# EasyEDA Pro project ProPrj_KiwiKey_2025-07-17.epro

# Schematic MainBoard
Board Name: MainBoard; Create Date: 2025-07-17; Page Name: P1; Project Name: KiwiKey; Schematic Name: MainBoard; Update Date: 2025-07-17; Company: EasyEDA.com; Drawn: 2025-07-17; Page Size: A4; Reviewed: 2025-07-17; Version: V1.0
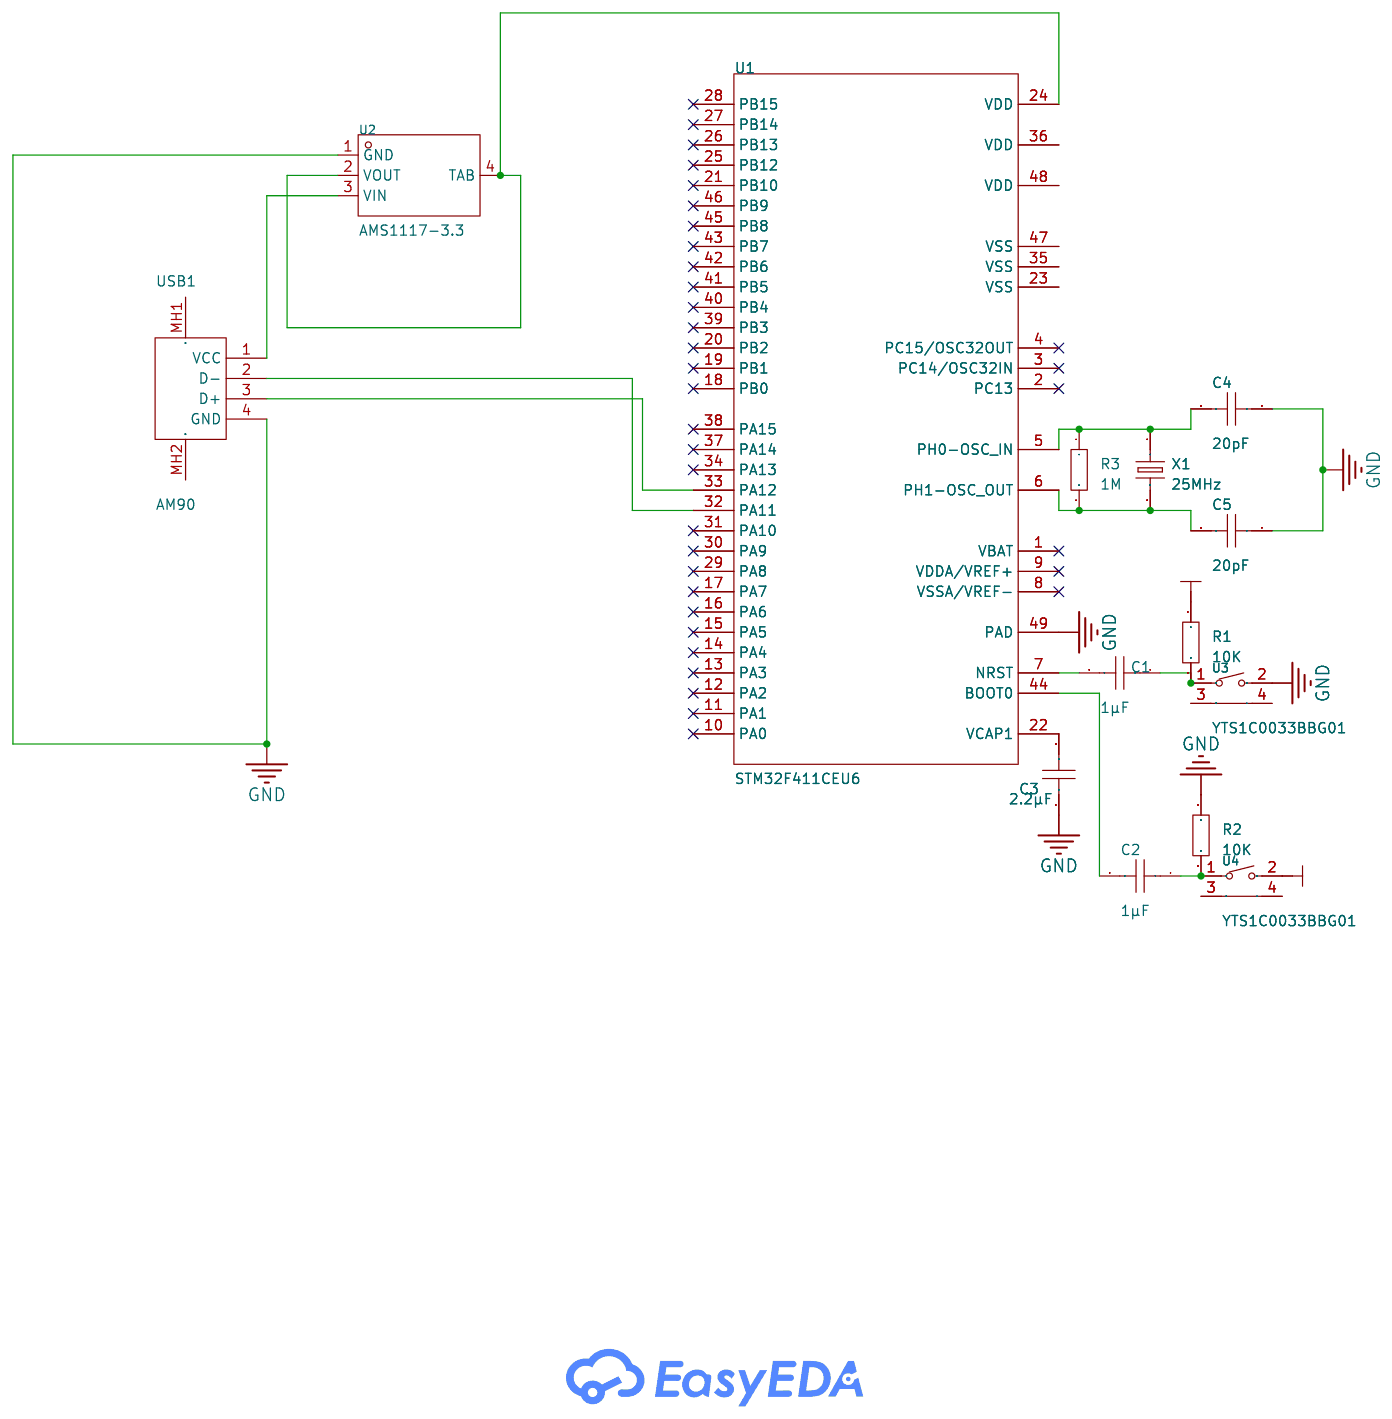
[diagram p0: schematic sheet]

## Parts
C1  1µF  [C0603]
C2  1µF  [C0603]
C3  2.2µF  [C0603]
C4  20pF  [C0603]
C5  20pF  [C0603]
R1  10K  [R0603]
R2  10K  [R0603]
R3  1M  [R0603]
U1  STM32F411CEU6  [UFQFPN-48_L7.0-W7.0-P0.50-BL-EP]
U2  AMS1117-3.3  [SOT-223-3_L6.5-W3.4-P2.30-LS7.0-BR]
U3  YTS1C0033BBG01  [SW-SMD_YIYUAN_YTS1C003XXX]
U4  YTS1C0033BBG01  [SW-SMD_YIYUAN_YTS1C003XXX]
USB1  AM90  [USB-AM-TH_AM90]
X1  25MHz  [HC-49US_L11.5-W4.5-P4.88]

## Library data of the parts
C1-C5 = CAP_0603: Supplier Footprint: 0603
R1-R3 = Res_0603: Supplier Footprint: 0603
U1 = STM32F411CEU6: CPU Core:ARM-M4 CPU Maximum Speed:100MHz Program Storage Size:512KB Program Memory Type:FLASH Number of I/O:36 ADC (Bit):12bit Voltage - Supply:1.7V~3.6V Voltage - Supply:1.7V~3.6V Applications:-; LCSC Part Name: 带DSP和FPU的高性能基本型系列ARM Cortex-M4 MCU，具有512 KB Flash、100 MHz CPU和ART加速器; Supplier Part: C60420; Manufacturer: ST(意法半导体); Supplier Footprint: UFQFPN-48(7x7); JLCPCB Part Class: Extended Part; Datasheet: https://atta.szlcsc.com/upload/public/pdf/source/20151026/1457707507170.pdf; Supplier: LCSC; CPU Core: ARM-M4; CPU Maximum Speed: 100MHz; Program Storage Size: 512KB; Program Memory Type: FLASH; Number of I/O: 36; ADC (Bit): 12bit; Voltage - Supply: 1.7V~3.6V
U2 = AMS1117-3.3_C351784: Output Type: Maximum Input Voltage:18V Output Voltage:3.3V Output Voltage:3.3V MAX Output Current:800mA Power Supply Rejection Ratio (PSRR):- Dropout Voltage:1.4V@(1A) Output Polarity:Positive electrode Number of Outputs:1; LCSC Part Name: 输入18V 输出3.3V 800mA; Supplier Part: C351784; Manufacturer: PUOLOP(迪浦); Supplier Footprint: SOT-223-3; JLCPCB Part Class: Extended Part; Datasheet: https://atta.szlcsc.com/upload/public/pdf/source/20210915/EA806799CEEC3F52E0A4FA8303A508AC.pdf; Supplier: LCSC; Maximum Input Voltage: 18V; Output Voltage: 3.3V; MAX Output Current: 800mA; Dropout Voltage: 1.4V@(1A); Output Polarity: Positive electrode; Number of Outputs: 1
U3 U4 = YTS1C0033BBG01: LCSC Part Name: 侧按键3x6x3.8 黑钮贴片; Supplier Part: C5188566; Manufacturer: YIYUAN(怡远); Supplier Footprint: SMD; JLCPCB Part Class: Extended Part; Datasheet: https://atta.szlcsc.com/upload/public/pdf/source/20230613/7D2A610AF4C94741A450B980E2010797.pdf; Supplier: LCSC
USB1 = AM90: Connector Type:Type-A Standard:USB 2.0 Gender:Public Mounting Style:Bend-in Number of Contacts:4P Number of Ports:1 Current Rating - Power (Max):1.5A Rated Voltage (Max):30V Connect-Disconnect Life:5000 Cuts Supplementary Features:- Center Height:- Length; LCSC Part Name: Type-A 公 弯插; Supplier Part: C404965; Manufacturer: SHOU HAN(首韩); Supplier Footprint: 插件; JLCPCB Part Class: Extended Part; Datasheet: https://atta.szlcsc.com/upload/public/pdf/source/20190722/C404965_9CC10BE28E3F9E5134758D030387C529.pdf; Supplier: LCSC; Connector Type: Type-A; Standard: USB 2.0; Gender: Public; Mounting Style: Bend-in; Number of Contacts: 4P; Number of Ports: 1; Current Rating - Power (Max): 1.5A; Rated Voltage (Max): 30V; Connect-Disconnect Life: 5000 Cuts; Length: 18.8mm; Core Colour: White; Operating Temperature Range: -25℃~+85℃
X1 = XIHCELNANF-25MHZ: Crystal Type:直插晶振 Frequency:25MHz Normal temperature Frequency Tolerance:±30ppm Normal temperature Frequency Tolerance:±30ppm External load capacitor:20pF Frequency Stability(Full temperature range):±30ppm Frequency Stability(Full temperature range):±30pp; LCSC Part Name: 25MHz ±30ppm 20pF; Supplier Part: C295079; Manufacturer: TAITIEN(泰艺电子); Supplier Footprint: HC-49S; JLCPCB Part Class: Extended Part; Datasheet: https://atta.szlcsc.com/upload/public/pdf/source/20190107/C358649_B3943D1FEB8737E4FCE005A191A94016.pdf; Supplier: LCSC; Crystal Type: 直插晶振; Normal temperature Frequency Tolerance: ±30ppm; External load capacitor: 20pF; Frequency Stability(Full temperature range): ±30ppm

## Nets
3.3V: R1.1 U4.2
GND: C3.1 C4.1 C5.1 R2.1 U1.49(PAD) U2.1(GND) U3.2 USB1.4(GND)
Net-(C1-1): C1.1 R1.2 U3.1
Net-(C1-2): C1.2 U1.7(NRST)
Net-(C2-1): C2.1 R2.2 U4.1
Net-(C2-2): C2.2 U1.44(BOOT0)
Net-(C3-2): C3.2 U1.22(VCAP1)
Net-(C4-2): C4.2 R3.1 U1.5(PH0-OSC_IN) X1.1
Net-(C5-2): C5.2 R3.2 U1.6(PH1-OSC_OUT) X1.2
Net-(U1-24): U1.24(VDD) U2.2(VOUT) U2.4(TAB)
Net-(U1-32): U1.32(PA11) USB1.2(D-)
Net-(U1-33): U1.33(PA12) USB1.3(D+)
Net-(U2-3): U2.3(VIN) USB1.1(VCC)

Not connected (* = marked no-connect by the designer): U1 1(VBAT)* 2(PC13)* 3(PC14/OSC32IN)* 4(PC15/OSC32OUT)* 8(VSSA/VREF-)* 9(VDDA/VREF+)* 10(PA0)* 11(PA1)* 12(PA2)* 13(PA3)* 14(PA4)* 15(PA5)* 16(PA6)* 17(PA7)* 18(PB0)* 19(PB1)* 20(PB2)* 21(PB10)* 23(VSS) 25(PB12)* 26(PB13)* 27(PB14)* 28(PB15)* 29(PA8)* 30(PA9)* 31(PA10)* 34(PA13)* 35(VSS) 36(VDD) 37(PA14)* 38(PA15)* 39(PB3)* 40(PB4)* 41(PB5)* 42(PB6)* 43(PB7)* 45(PB8)* 46(PB9)* 47(VSS) 48(VDD); U3 3 4; U4 3 4; USB1 MH1 MH2

# Board PCB1_1
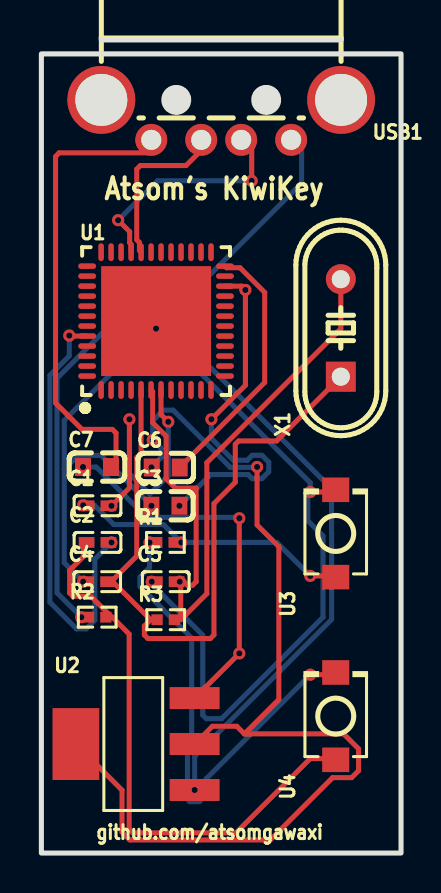
[diagram p1: board, top side]
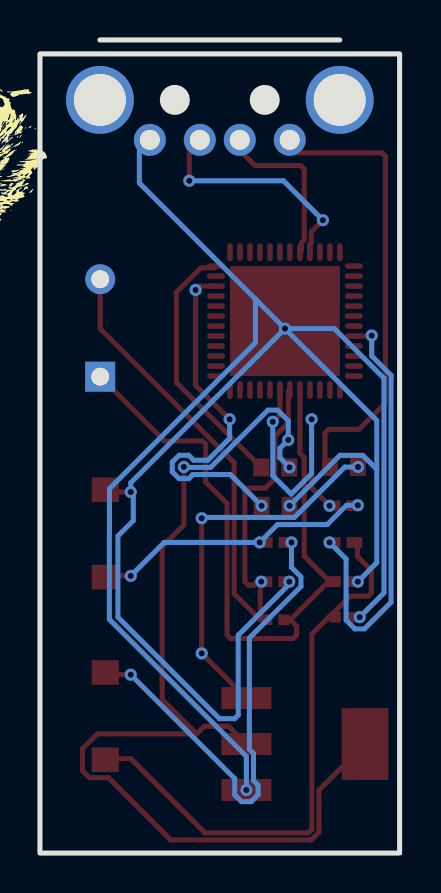
[diagram p2: board, bottom side, seen from below]

Outline 18 x 40.7 mm; copper layers: Top Layer, Bottom Layer. Coordinates in mm from the lower left corner of the outline.
Outline path: rectangle 0,40 18,0
Stack: Top Layer 0.035mm / Dielectric1 1.51mm FR4 er 4.5 / Bottom Layer 0.035mm

## Design rules (mm)
template: JLCPCB Capability(Two Layers Board)
spacing copperThickness1oz (default): track to track 0.102, other pairs 0.152 to 0.3
spacing copperThickness2oz: track to track 0.203, other pairs 0.152 to 0.3
track width copperThickness1oz (default): min 0.127, default 0.254, max 2.54
track width copperThickness2oz: min 0.203, default 0.254, max 2.54
differential pair differentialPair (default): width min 0.127, default 0.254, max 2.54; gap min 0.152, default 0.152
via viaSize (default): diameter min 0.5, default 0.61, max 10; hole min 0.3, default 0.305, max 6.3

## Placement (name value [footprint] x y rotation side)
C1  1uF  [C0402]  2.81 17.38 0 top
C2  1uF  [C0402]  2.81 15.55 0 top
C3  2.2uF  [C0603]  6.21 17.38 0 top
C4  20pF  [C0402]  2.79 13.58 0 top
C5  20pF  [C0402]  6.22 13.58 0 top
C6  22uF  [C0603]  6.22 19.3 0 top
C7  10uF  [C0603]  2.78 19.32 0 top
R1  10kΩ  [R0402]  6.21 15.55 0 top
R2  10kΩ  [R0402]  2.79 11.81 0 top
R3  1MΩ  [R0402]  6.22 11.68 0 top
U1  STM32F411CEU6  [UFQFPN-48_L7.0-W7.0-P0.50-BL-EP]  5.74 26.63 0 top
U2  AMS1117-3.3  [SOT-223-3_L6.5-W3.4-P2.30-LS7.0-BR]  4.7 5.46 0 top
U3  TS-1088-AR02016  [SW-SMD_L3.9-W3.0-P4.45]  14.73 16 90 top
U4  TS-1088-AR02016  [SW-SMD_L3.9-W3.0-P4.45]  14.73 6.85 90 top
USB1  AM90-01-T1-B  [USB-A-TH_AM90-01-T1-B]  9 36.7 180 top
X1  25MHz  [HC-49US_L11.5-W4.5-P4.88]  14.99 26.28 90 top

## Footprints (pads in the part's own frame, mm; a bottom-side part is the same pattern mirrored in y, then rotated)
C0402
  rect 0.79x0.54 smd: 1(-0.545,0) 2(0.545,0)
C0603
  rect 0.8x0.9 smd: 1(-0.7,0) 2(0.7,0)
HC-49US_L11.5-W4.5-P4.88
  rect 1.5x1.5 hole 0.9: 1(-2.44,0)
  round 1.5 hole 0.9: 2(2.44,0)
R0402
  rect 0.566x0.54 smd: 1(-0.433,0) 2(0.433,0)
SOT-223-3_L6.5-W3.4-P2.30-LS7.0-BR
  rect 2.5x1.1 smd: 1(2.97,-2.3) 2(2.97,0) 3(2.97,2.3)
  rect 2.34x3.6 smd: 4(-2.97,0)
SW-SMD_L3.9-W3.0-P4.45
  rect 1.23x1.36 smd: 1(-2.185,0) 2(2.185,0)
UFQFPN-48_L7.0-W7.0-P0.50-BL-EP
  oval 0.28x0.9 smd: 1(-2.751,-3.45) 2(-2.251,-3.45) 3(-1.75,-3.45) 4(-1.25,-3.45) 5(-0.749,-3.45) 6(-0.249,-3.45) 7(0.249,-3.45) 8(0.75,-3.45) 9(1.25,-3.45) 10(1.75,-3.45) 11(2.251,-3.45) 12(2.751,-3.45) 25(2.751,3.449) 26(2.251,3.449) 27(1.75,3.449) 28(1.25,3.449) 29(0.75,3.449) 30(0.249,3.449) 31(-0.249,3.449) 32(-0.749,3.449) 33(-1.25,3.449) 34(-1.75,3.449) 35(-2.251,3.449) 36(-2.751,3.449)
  oval 0.9x0.28 smd: 13(3.45,-2.751) 14(3.45,-2.251) 15(3.45,-1.75) 16(3.45,-1.25) 17(3.45,-0.75) 18(3.45,-0.249) 19(3.45,0.249) 20(3.45,0.749) 21(3.45,1.25) 22(3.45,1.75) 23(3.45,2.251) 24(3.45,2.751) 37(-3.449,2.751) 38(-3.449,2.251) 39(-3.449,1.75) 40(-3.449,1.25) 41(-3.449,0.749) 42(-3.449,0.249) 43(-3.449,-0.249) 44(-3.449,-0.75) 45(-3.449,-1.25) 46(-3.449,-1.75) 47(-3.449,-2.251) 48(-3.449,-2.751)
  rect 5.5x5.5 smd: 49(0,0)
USB-A-TH_AM90-01-T1-B
  round 1.6 hole 1: 1(3.5,1) 2(1,1) 3(-1,1) 4(-3.5,1)
  round 3.4 hole 2.6: 5(-6,-1) 6(6,-1)

## Nets
3.3V: R1.1 U4.2
GND: C3.1 C4.1 C5.1 R2.1 U1.49 U2.1 U3.2 USB1.4
$1N1101: U1.32 USB1.2
$1N1107: U1.33 USB1.3
$1N1581: C1.2 U1.7
$1N1585: C1.1 R1.2 U3.1
$1N1612: C2.1 R2.2 U4.1
$1N1616: C2.2 U1.44
$1N1833: C4.2 R3.1 U1.5 X1.1
$1N1838: C5.2 R3.2 U1.6 X1.2
$1N1896: C3.2 U1.22
$1N2376: C6.1 U2.2 U2.4
$1N2381: C6.2 U1.24
$1N2418: C7.2 USB1.1
$1N2424: C7.1 U2.3

Pads without a net: U1 1 2 3 4 8 9 10 11 12 13 14 15 16 17 18 19 20 21 23 25 26 27 28 29 30 31 34 35 36 37 38 39 40 41 42 43 45 46 47 48; USB1 5 6

## Via types
v1: diameter 0.61, hole 0.305, Top Layer to Bottom Layer, 29 vias

## Routing (per net, layer and track width the routed paths; a pad name or vN(x,y) marks a point on that pad's centre or on a via; arc(x,y) is an arc through that point)
3.3V: length 25
  Top Layer w0.254: v1(13.46,8.93) 14.62,8.93 U4.2
  Bottom Layer w0.254: v1(5.41,15.55) 5.41,14.3 4.94,13.83 4.94,13.34 7.52,10.76 7.52,5.19 7.31,4.98 7.31,3.63 7.09,3.4 7.09,2.91 7.43,2.57 7.91,2.57 8.25,2.91 8.25,3.72 v1(13.46,8.93)
GND: length 117.7
  Top Layer w0.254: v1(13.46,18.07) 14.62,18.07 U3.2 ; v1(5.74,26.25) U1.49
  Bottom Layer w0.254: v1(5.51,17.38) 2.99,19.91 1.84,19.91 1.14,19.21 ; v1(5.52,13.58) 5.52,13.46 8.08,10.9 8.08,6.91 8.25,6.73 9.02,6.73 14.1,11.81 14.1,15.87 13.33,16.64 13.33,17.94 v1(13.46,18.07) 13.46,18.53 v1(5.74,26.25) ; 1.14,19.21 1.14,21.65 v1(5.74,26.25) ; 1.14,19.21 1.14,14.53 v1(2.09,13.58) ; v1(5.74,26.25) 3.27,26.25 0.78,23.77 0.78,13.02 v1(2,11.81) ; v1(5.74,26.25) 7.22,27.73 ; 13.03,35.7 13.03,33.54 7.22,27.73 ; 7.22,27.73 7.22,25.55 14.52,18.24 14.52,16 14.53,15.99 14.53,11.69 7.67,4.84 v1(7.67,3.16)
$1N1101: length 8.6
  Top Layer w0.254: 8.53,35.7 7.24,34.41 4.95,34.41 4.77,34.23 4.77,30.69 4.91,30.56 4.91,30.16 U1.32
$1N1107: length 11.4
  Top Layer w0.254: U1.33 4.49,30.47 4.42,30.55 4.42,31.1 v1(3.84,31.68) ; 10.53,35.7 v1(10.53,33.65)
  Bottom Layer w0.254: v1(3.84,31.68) 5.81,33.65 v1(10.53,33.65)
$1N1581: length 14.6
  Top Layer w0.254: v1(4.41,21.71) 4.41,18.28 v1(3.51,17.38) ; 5.99,23.18 5.99,21.95 v1(6.35,21.58)
  Bottom Layer w0.254: v1(6.35,21.58) 6.35,18.89 5.43,17.97 4.41,18.99 v1(4.41,21.71)
$1N1585: length 14.1
  Top Layer w0.254: U3.1 14.67,13.87 v1(13.46,13.87)
  Bottom Layer w0.254: v1(2.09,17.41) 2.66,17.41 3.62,16.44 6.11,16.44 v1(7,15.55) 11.78,15.55 v1(13.46,13.87)
$1N1612: length 28.4
  Top Layer w0.254: 2.11,15.55 2.11,14.84 1.41,14.15 1.41,13.02 1.58,12.86 2.47,12.86 3.52,11.81 3.55,11.81 4.39,10.96 4.39,1.19 4.57,1.01 9.74,1.01 13.46,4.73 14.67,4.73 U4.1
$1N1616: length 21.9
  Top Layer w0.254: 2.29,25.88 1.42,25.88 v1(1.4,25.9)
  Bottom Layer w0.254: v1(1.4,25.9) 1.4,24.88 0.43,23.91 0.43,12.55 1.76,11.22 2.24,11.22 2.68,11.66 2.68,14.72 v1(3.51,15.55)
$1N1833: length 34.2
  Top Layer w0.254: 4.99,23.18 4.99,20.01 4.77,19.79 4.77,14.86 3.49,13.58 3.56,13.58 5.47,11.68 5.15,11.36 5.15,10.92 5.33,10.74 8.46,10.74 8.64,10.92 8.64,17.49 9.71,18.56 9.71,20.46 9.87,20.63 11.77,20.63 X1.1
$1N1838: length 34.4
  Top Layer w0.254: 5.49,23.18 5.57,23.1 5.57,21.54 6.24,20.86 6.24,18.73 6.72,18.26 7.75,18.26 7.75,13.58 7.57,13.4 7.31,13.4 7.13,13.58 v1(6.92,13.58) 6.98,13.53 6.98,11.68 8.28,12.98 8.28,19.54 14.99,26.25 X1.2
$1N1896: length 18.6
  Top Layer w0.254: U1.22 10.02,28.38 v1(10.21,28.18) 10.21,23.41 v1(8.51,21.71)
  Bottom Layer w0.254: v1(8.51,21.71) 8.51,20.76 9.61,19.66 10.3,19.66 10.55,19.91 11.04,19.91 11.38,19.57 11.38,19.08 11.04,18.74 10.55,18.74 10.35,18.95 8.47,18.95 v1(6.91,17.38)
$1N2376: length 52.8
  Top Layer w0.254: U2.2 8.56,6.34 9.78,6.34 10.16,5.96 ; v1(10.79,19.32) 10.79,16.42 11.88,15.33 11.88,7.69 10.16,5.96 ; 10.16,5.96 15.13,5.96 15.88,5.21 15.88,4.12 15.53,3.77 14.57,3.77 11.46,0.66 4.42,0.66 4.04,1.04 4.04,3.15 U2.4
  Bottom Layer w0.254: v1(5.51,19.3) 5.99,19.79 5.99,20.26 v1(5.57,20.68) 5.57,21.64 6.11,22.17 6.59,22.17 9.46,19.3 10.77,19.3 v1(10.79,19.32)
$1N2381: length 13.1
  Top Layer w0.254: C6.2 11.18,23.55 11.18,28.06 9.94,29.3 9.27,29.3 9.19,29.38
$1N2418: length 23.5
  Top Layer w0.254: 6.03,35.7 5.37,35.05 0.89,35.05 0.71,34.87 0.71,22.53 2.03,21.2 3.56,21.2 3.74,21.02 3.74,19.57 3.48,19.32
$1N2424: length 18.8
  Top Layer w0.254: v1(9.91,16.76) v1(9.91,9.99) U2.3
  Bottom Layer w0.254: v1(9.91,16.76) 9.87,16.8 5.27,16.8 2.74,19.32 v1(2.08,19.32)

## Text on the board
Top Silkscreen Layer: github.com/atsomgawaxi | Atsom's KiwiKey
